# Altium schematic sheet SH3 - 17V POWER.SchDoc: =documentname
size B; DrawnBy: Farris Matar; Organization: UW Robotics; Address1: 200 University Avenue; Address2: Waterloo; Address3: Ontario; Address4: Canada N2L 3G6; DocumentNumber: 6; SheetNumber: 3
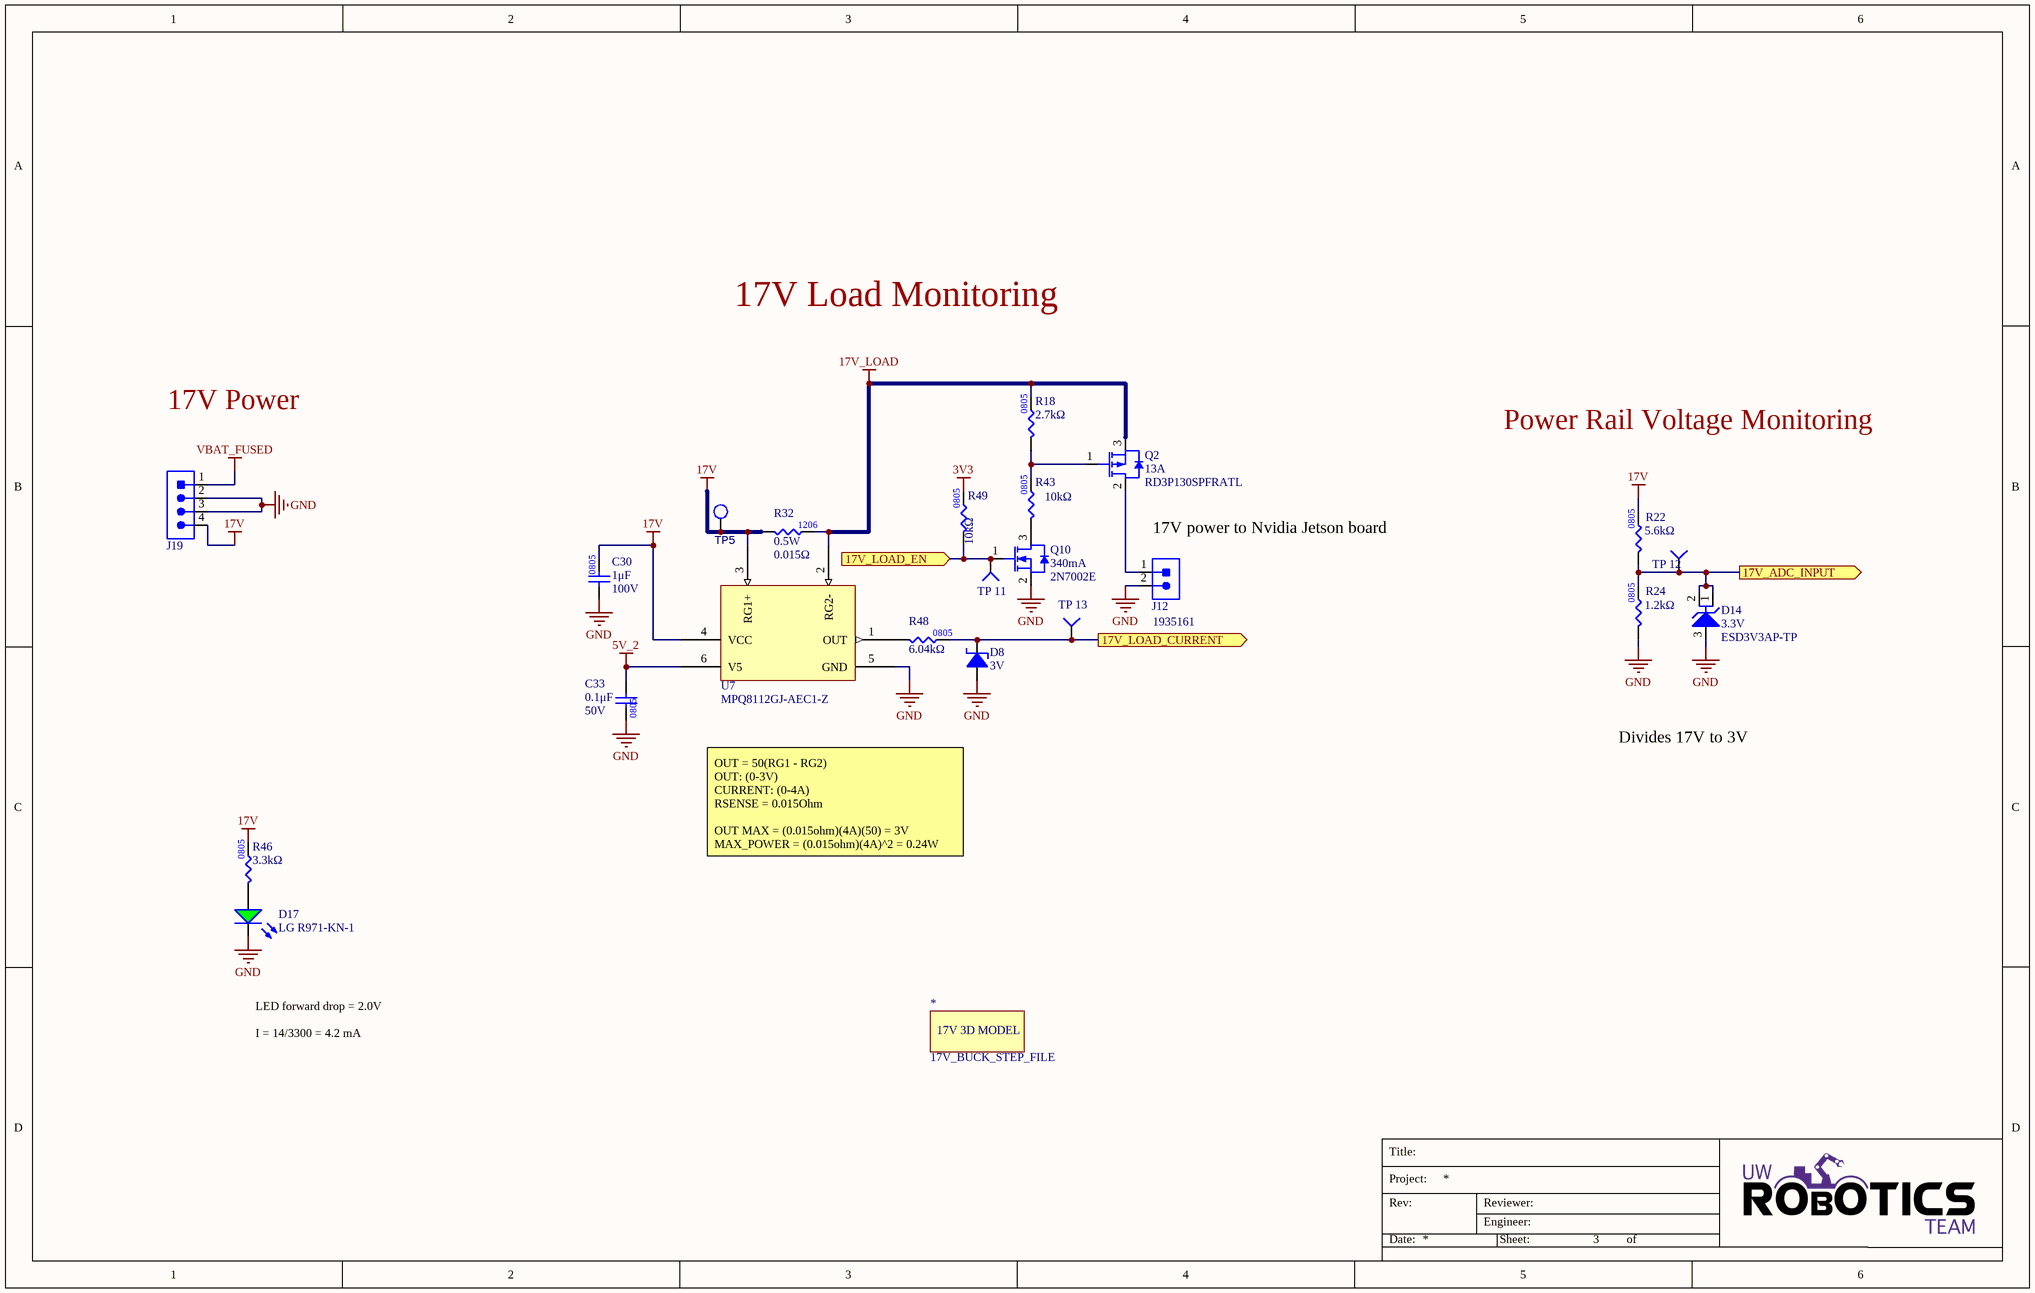
[diagram p0: SH3 - 17V POWER.SchDoc]

## Parts
*  17V_BUCK_STEP_FILE  [17V_3D_MODEL]
C30  value 1μF  Voltage Rating: 100V  [CAP0805]  (hidden comment: CAP_1uF_100V_0805)
C33  value 0.1μF  Voltage Rating: 50V  [CAP2012]  (hidden comment: CAP_0.1uF_50V_0805)
D8  Working Voltage: 3V  [MMSZ4683-TP]  (hidden comment: DIO_ZENER_3V)
D14  Voltage - Reverse Standoff (Typ): 3.3V  [ESD3V3AP-TP]  (hidden comment: TVS_DIODE_3.3V_13.3A)
D17  Manufacturer Part Number 1: LG R971-KN-1  [LED_0805_GREEN]  (hidden comment: LED_GREEN)
J12  CON_2M_TERM  [1935161]  (value not drawn)
J19  CON_2POS_SCREW_TERM  [MPS-04-7.70-01-L-V]  (value not drawn)
Q2  Current - Continous Drain: 13A  [RD3P130SPFRATL]  (hidden comment: PMOS_100V_13A)
Q10  Id: 340mA  Manufacturer Part Number 1: 2N7002E  [SOT23-3]  (hidden comment: NMOS_60V_340mS)
R18  value 2.7kΩ  [RES0805]  (hidden comment: RES_2.7kΩ_0805_1%)
R22  value 5.6kΩ  [RES0805]  (hidden comment: RES_5.6kΩ_0805)
R24  value 1.2kΩ  [RES0805]  (hidden comment: RES_1.2kΩ_0805)
R32  value 0.015Ω  Power: 0.5W  [RES1206]  (hidden comment: RES_0.015Ω_1206_1%)
R43  value 10kΩ  [RES0805]  (hidden comment: RES_10kΩ_0805_5%)
R46  value 3.3kΩ  [RES0805]  (hidden comment: RES_3.3kΩ_0805_1%)
R48  value 6.04kΩ  [RES0805]  (hidden comment: RES_6.04kΩ_0805_1%)
R49  value 10kΩ  [RES0805]  (hidden comment: RES_10kΩ_0805_5%)
TP5  TESTPOINT_LOOP  [TESTPOINT_LOOP]  (value not drawn)
TP_11  TESTPOINT_1MM_CIRCLE  [TESTPOINT_CIRCLE_1MM]  (value not drawn)  (no BOM)
TP_12  TESTPOINT_1MM_CIRCLE  [TESTPOINT_CIRCLE_1MM]  (value not drawn)  (no BOM)
TP_13  TESTPOINT_1MM_CIRCLE  [TESTPOINT_CIRCLE_1MM]  (value not drawn)  (no BOM)
U7  MPQ8112GJ-AEC1-Z  [MPQ8112GJ-AEC1-Z]

## Ports
17V_ADC_INPUT (out), 17V_LOAD_CURRENT (out), 17V_LOAD_EN (in)

## Nets
3V3: R49.2
5V_2: C33.2 U7.6(V5)
17V: C30.2 J19.4 R22.2 R32.1 R46.2 TP5.1 U7.3(RG1+) U7.4(VCC)
17V_LOAD: Q2.3(Source) R18.2 R32.2 U7.2(RG2-)
GND: C30.1 C33.1 D8.2(Anode) D14.3 D17.2(K) J12.2 J19.2 J19.3 Q10.2(Source) R24.1 U7.5(GND)
VBAT_FUSED: J19.1
17V_ADC_INPUT: D14.1 D14.2 R22.1 R24.2 TP_12.1(=value) ; port 17V_ADC_INPUT
17V_LOAD_CURRENT: D8.1(Cathode) R48.2 TP_13.1(=value) ; port 17V_LOAD_CURRENT
17V_LOAD_EN: Q10.1(Gate) R49.1 TP_11.1(=value) ; port 17V_LOAD_EN
NetD17_1: D17.1(A) R46.1
NetJ12_1: J12.1 Q2.2(Drain)
NetQ2_1: Q2.1(Gate) R18.1 R43.2
NetQ10_3: Q10.3(Drain) R43.1
NetR48_1: R48.1 U7.1(OUT)

## Notes on the sheet
- 17V Load Monitoring
- 17V Power
- Power Rail Voltage Monitoring
- (near J12) 17V power to Nvidia Jetson board
- Divides 17V to 3V
- OUT = 50(RG1 - RG2)
  OUT: (0-3V)
  CURRENT: (0-4A)
  RSENSE = 0.015Ohm
  OUT MAX = (0.015ohm)(4A)(50) = 3V
  MAX_POWER = (0.015ohm)(4A)^2 = 0.24W
- LED forward drop = 2.0V
  I = 14/3300 = 4.2 mA
- Title:
- Project:
- Date:
- Rev:
- Reviewer:
- Engineer:
- Sheet:
- of
- (in symbol 17V_BUCK_STEP_FILE) 17V 3D MODEL
- (in symbol RES_0.015Ω_1206_1%) 1206

## Library data of the parts
C30 = CAP_1uF_100V_0805: CAP CER 1UF 100V X7S 0805; Supplier 1: Digi-Key; Mounting Type: SMD; Package: 0805; Supplier Part Number 1: 490-14464-1-ND
C33 = CAP_0.1uF_50V_0805: CAP CER 0.1UF 50V X7R 0805; Manufacturer Part Number 1: GCM21BR71H104KA37K; Manufacturer 1: Murata Electronics; Package/Footprint: 0805; Supplier Part Number 1: 490-8049-1-ND; Supplier 1: Digi-Key; Dielectric: X7R; LCSC Part #: C49678; Mounting Type: SMD
D8 = DIO_ZENER_3V: DIODE ZENER 3V 500MW SOD123; Manufacturer 1: Micro Commercial Co; Forward Voltage: 0.95V; Manufacturer Part Number 1: MMSZ4683-TP; Supplier Part Number 1: MMSZ4683-TPMSCT-ND; Supplier 1: Digi-Key; Package/Case: SOD-123
D14 = TVS_DIODE_3.3V_13.3A: TVS DIODE 3.3VWM 7.5VC SOT23; Manufacturer 1: Micro Commercial Co; Package/Footprint: SOT-23; Voltage - Breakdown (Min): 5V; Voltage - Clamping (Max) @ Ipp: 7.5V; Mounting Type: SMD; Supplier 1: Digi-Key; Supplier Part Number 1: ESD3V3AP-TPMSCT-ND; Manufacturer Part Number 1: ESD3V3AP-TP
D17 = LED_GREEN: LED GREEN DIFFUSED 0805 SMD; Manufacturer 1: OSRAM; Forward Voltage Drop: 2.2V; Package/Footprint: 0805; Mounting Type: SMD; Supplier 1: Digi-Key; Supplier Part Number 1: 475-1410-1-ND; Supplier 2: Future Electronics; Supplier Part Number 2: 1152237
J12 = CON_2M_TERM: TERM BLK 2POS SIDE ENTRY 5MM; Manufacturer 1: Phoenix Contact; Max Current Rating: 16A; Current: 18A; Voltage: 300V; Package/Footprint: SMD; Supplier 1: Digi-Key; Supplier Part Number 1: 277-1667-ND; Manufacturer Part Number 1: 1935161; Mounting Type: TH
J19 = CON_4POS_POWERBLADE_FEM: VERTICAL MINI-POWER SKT; Manufacturer 1: Samtec Inc.; Package/Footprint: PowerStrip™ 30 MPS; Supplier 1: Digi-Key; Mounting Type: TH; Supplier Part Number 1: SAM9721-ND; Manufacturer Part Number 1: MPS-04-7.70-01-L-V
Q2 = PMOS_100V_13A: MOSFET P-CH 100V 13A TO252; Manufacturer 1: Rohm Semiconductor; Vgs (Max): ±20V; Package/Footprint: D2Pak; Mounting Type: SMD; Verified: No; Vdss: 100V; Supplier 1: Digi-Key; Supplier Part Number 1: RD3P130SPFRATLCT-ND; Manufacturer Part Number 1: RD3P130SPFRATL
Q10 = NMOS_60V_340mS: N-Channel 60 V 340mA (Ta) 350mW (Ta) Surface Mount SOT-23; Manufacturer 1: ANBON SEMICONDUCTOR (INT'L) LIMITED; Vgs (Max): ±20V; Vdss: 60V; Supplier 1: Digi-Key; Supplier Part Number 1: 4530-2N7002ECT-ND; Mounting Type: SMD; Package/Footprint: SOT-23; Verified: No
R18 = RES_2.7kΩ_0805_1%: RES 2.7K OHM 1% 1/8W 0805; Manufacturer 1: Panasonic Electronic Components; Manufacturer Part Number 1: ERJ-6ENF2701V; Supplier 1: Digi-Key; Supplier Part Number 1: P2.70KCCT-ND; Mounting Type: SMD; LCSC Part #: C17530; Package: 0805
R22 = RES_5.6kΩ_0805_5%: RES 5.6K OHM 5% 1/8W 0805; Manufacturer 1: Yageo; Manufacturer Part Number 1: RC0805JR-075K6L; Supplier Part Number 1: 311-5.6KARCT-ND; Supplier 1: Digi-Key; Tolerance: 5%; Package: 0805
R24 = RES_1.2kΩ_0805_5%: RES 1.2K OHM 5% 1/8W 0805; Manufacturer 1: Yageo; Manufacturer Part Number 1: RC0805JR-071K2L; Supplier 1: Digi-Key; Supplier Part Number 1: 311-1.2KARCT-ND; Tolerance: 5%; Package: 0805
R32 = RES_0.015Ω_1206_1%: RES 0.015 OHM 1% 1/2W 1206; Manufacturer 1: Yageo; Manufacturer Part Number 1: CSR1206FK15L0; Supplier Part Number 1: CSR1206FK15L0CT-ND; Supplier 1: Digi-Key
R43 R49 = RES_10kΩ_0805_5%: RES 10K OHM 5% 1/8W 0805; Manufacturer 1: Panasonic Electronic Components; Manufacturer Part Number 1: ERJ-6GEYJ103V; Package/Footprint: 0805; Supplier 1: Digi-Key; Supplier Part Number 1: P10KACT-ND; LCSC Part #: C17414; Mounting Type: SMD
R46 = RES_3.3kΩ_0805_1%: RES 3.3K OHM 1% 1/8W 0805; Manufacturer 1: Vishay Dale; Manufacturer Part Number 1: CRCW06033K30FKEA; Mounting Type: SMD; Supplier 1: Digi-Key; Supplier Part Number 1: 541-3.30KHCT-ND; LCSC Part #: C26010; Package: 0805
R48 = RES_6.04kΩ_0805_1%: RES 6.04K OHM 1% 1/8W 0805; Manufacturer 1: Yageo; Manufacturer Part Number 1: RC0805FR-076K04L; Package/Footprint: 0805; Mounting Type: SMD; Supplier 1: Digi-Key; Supplier Part Number 1: 311-6.04KCRCT-ND
TP5 = TESTPOINT_LOOP: TESTPOINT THRUHOLE; Manufacturer 1: Keystone Electronics; Manufacturer Part Number 1: 5002; Package/Footprint: TH; Supplier Part Number 1: 36-5002-ND; Supplier 1: Digi-Key; Mounting Type: TH
TP_11-TP_13 = TESTPOINT_1MM_CIRCLE: TESTPOINT 1MM CIRCLE
U7 = MPQ8112GJ-AEC1-Z: 60V, HIGH-SIDE CURRENT-SENSE AMP; Manufacturer: Monolithic Power Systems Inc.; Vmin: 2.7V; Gain: 50; Supplier: Digi-Key; Supplier Part Number: 1589-MPQ8112GJ-AEC1-ZCT-ND; Vmax: 60V; Supplier 1: Digi-Key; Supplier Part Number 1: 1589-MPQ8112GJ-AEC1-ZCT-ND; Manufacturer Part Number: MPQ8112GJ-AEC1-Z